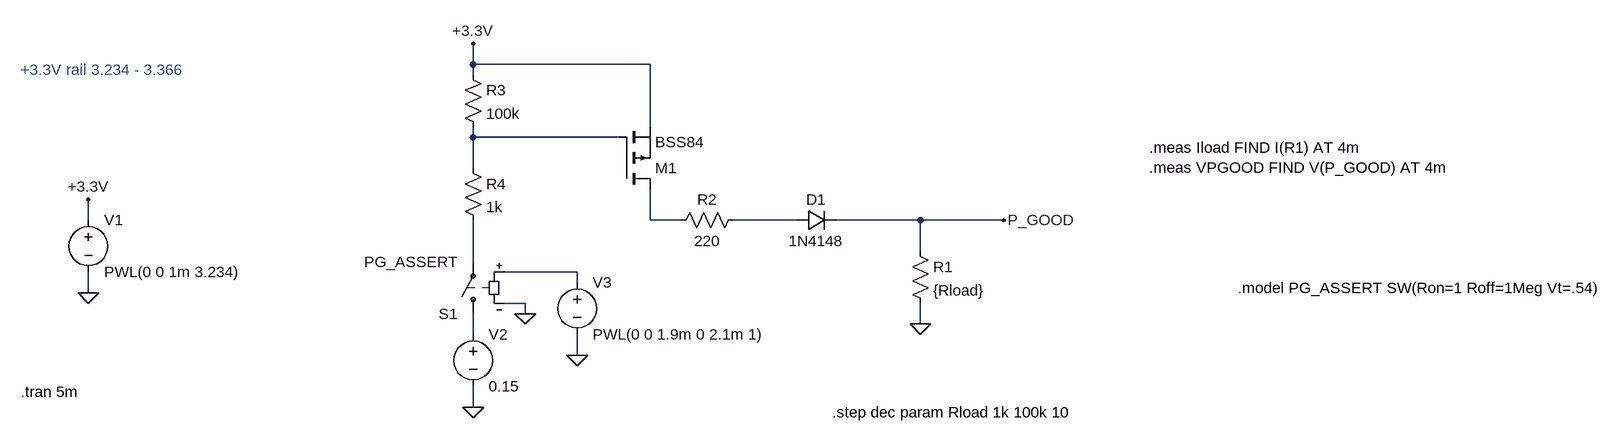
[diagram p0: schematic P_GOOD.asc]
P_GOOD.asc, the LTspice schematic file:
Version 4
SHEET 1 3336 996
WIRE -16 -224 -16 -256
WIRE 256 -224 -16 -224
WIRE -16 -208 -16 -224
WIRE 256 -128 256 -224
WIRE -16 -112 -16 -128
WIRE 208 -112 -16 -112
WIRE -16 -64 -16 -112
WIRE -608 16 -608 -16
WIRE 256 16 256 -32
WIRE 304 16 256 16
WIRE 480 16 384 16
WIRE 672 16 544 16
WIRE 800 16 672 16
WIRE 672 64 672 16
WIRE -16 80 -16 16
WIRE 144 96 32 96
WIRE 144 112 144 96
WIRE -608 128 -608 96
WIRE 64 144 32 144
WIRE 64 160 64 144
WIRE 672 176 672 144
WIRE -16 192 -16 160
WIRE 144 224 144 192
WIRE -16 304 -16 272
FLAG -608 128 0
FLAG 672 176 0
FLAG -608 -16 +3.3V
FLAG -16 -256 +3.3V
FLAG 800 16 P_GOOD
FLAG -16 304 0
FLAG 64 160 0
FLAG 144 224 0
SYMBOL voltage -608 0 R0
WINDOW 123 0 0 Left 0
WINDOW 39 0 0 Left 0
SYMATTR InstName V1
SYMATTR Value PWL(0 0 1m 3.234)
SYMBOL diode 480 32 R270
WINDOW 0 32 32 VTop 2
WINDOW 3 0 32 VBottom 2
SYMATTR InstName D1
SYMATTR Value 1N4148
SYMBOL res 656 48 R0
SYMATTR InstName R1
SYMATTR Value {Rload}
SYMBOL res 400 0 R90
WINDOW 0 0 56 VBottom 2
WINDOW 3 32 56 VTop 2
SYMATTR InstName R2
SYMATTR Value 220
SYMBOL pmos 208 -32 M180
SYMATTR InstName M1
SYMATTR Value BSS84
SYMBOL res -32 -224 R0
SYMATTR InstName R3
SYMATTR Value 100k
SYMBOL res -32 -80 R0
SYMATTR InstName R4
SYMATTR Value 1k
SYMBOL sw -16 176 R180
SYMATTR InstName S1
SYMATTR Value PG_ASSERT
SYMBOL voltage -16 176 R0
WINDOW 123 0 0 Left 0
WINDOW 39 0 0 Left 0
SYMATTR InstName V2
SYMATTR Value 0.15
SYMBOL voltage 144 96 R0
WINDOW 123 0 0 Left 0
WINDOW 39 0 0 Left 0
SYMATTR InstName V3
SYMATTR Value PWL(0 0 1.9m 0 2.1m 1)
TEXT -712 -216 Left 2 ;+3.3V rail 3.234 - 3.366
TEXT -712 280 Left 2 !.tran 5m
TEXT 536 312 Left 2 !.step dec param Rload 1k 100k 10
TEXT 1024 -96 Left 2 !.meas Iload FIND I(R1) AT 4m\n.meas VPGOOD FIND V(P_GOOD) AT 4m
TEXT 1160 120 Left 2 !.model PG_ASSERT SW(Ron=1 Roff=1Meg Vt=.54)

The netlist it stands for:
* P_GOOD.asc
V1 +3.3V 0 PWL(0 0 1m 3.234)
D1 N003 P_GOOD 1N4148
R1 P_GOOD 0 {Rload}
R2 N003 N002 220
M1 N002 N001 +3.3V +3.3V BSS84
R3 +3.3V N001 100k
R4 N001 N004 1k
S1 N006 N004 N005 0 PG_ASSERT
V2 N006 0 0.15
V3 N005 0 PWL(0 0 1.9m 0 2.1m 1)
.model D D
.lib standard.dio
.model NMOS NMOS
.model PMOS PMOS
.lib standard.mos
* +3.3V rail 3.234 - 3.366
.tran 5m
.step dec param Rload 1k 100k 10
.meas Iload FIND I(R1) AT 4m
.meas VPGOOD FIND V(P_GOOD) AT 4m
.model PG_ASSERT SW(Ron=1 Roff=1Meg Vt=.54)
.backanno
.end